# Altium project sy8502Regulator.PrjPcb
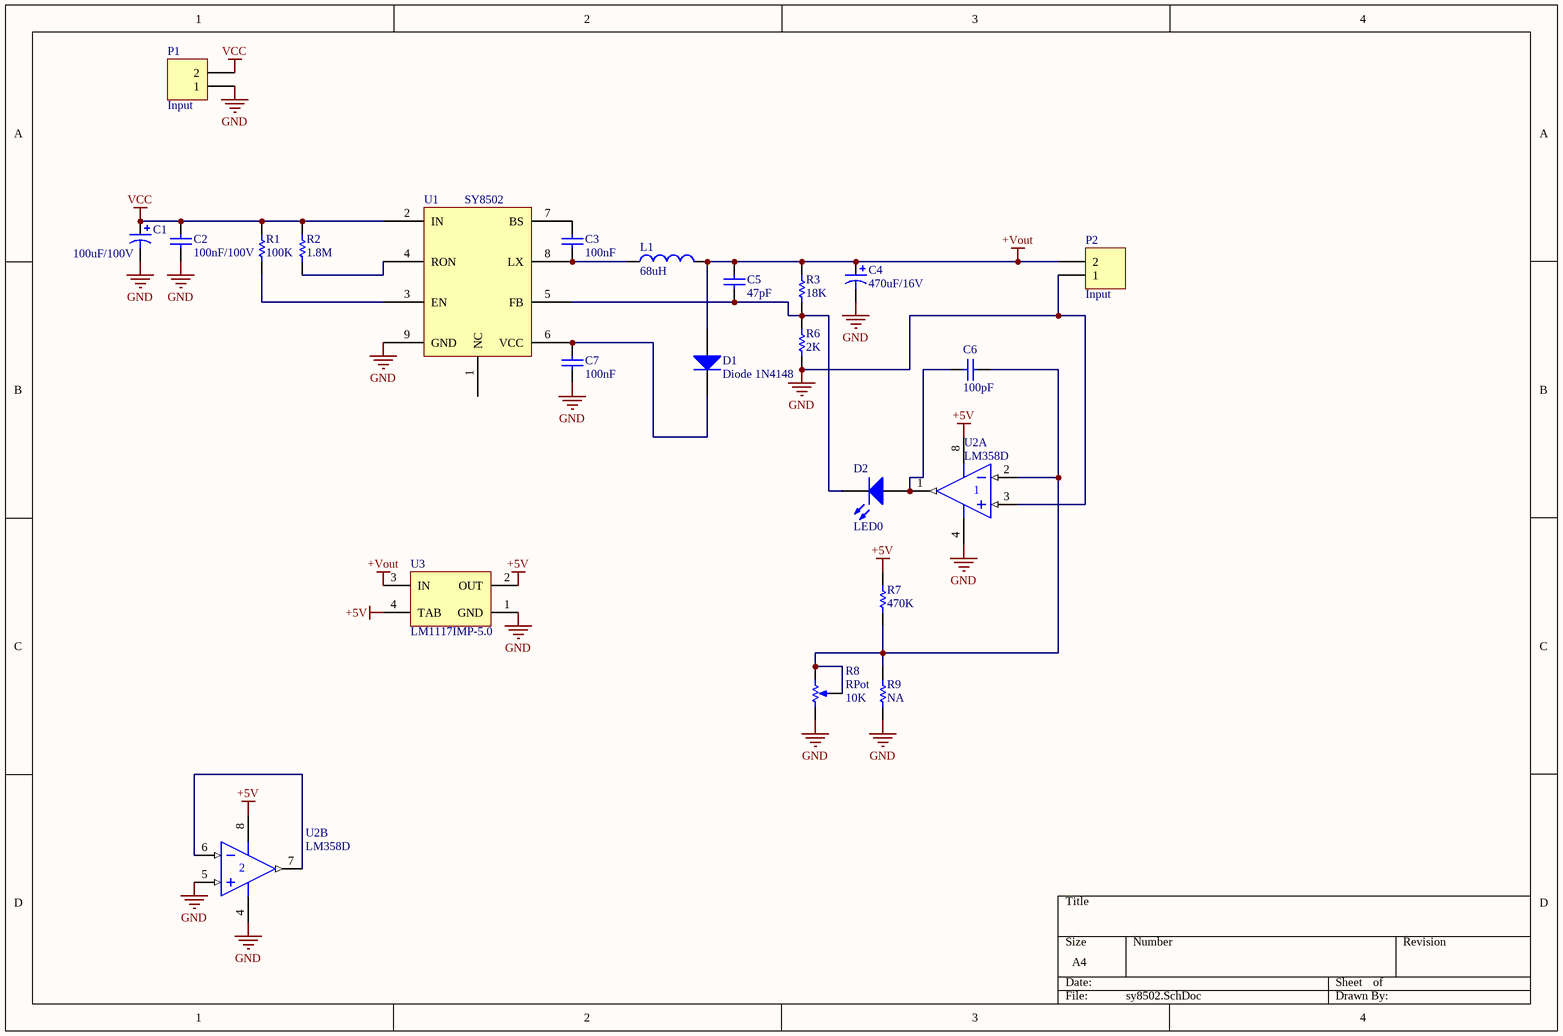
[diagram p0: sy8502.SchDoc]
1 sheet, 22 parts. Net scope: global (net labels, ports and power ports of the same name join across sheets).
Board file: SY8502.PcbDoc

## Sheet sy8502.SchDoc
size A4; SheetNumber: 1; SheetTotal: 1

### Parts
C1  100uF/100V  [C_EL_8]
C2  100nF/100V  [1206-Cap-S]
C3  100nF  [1206-Cap-S]
C4  470uF/16V  [C_EL_8]
C5  47pF  [1206-Cap-S]
C6  100pF  [1206-Cap-S]
C7  100nF  [1206-Cap-S]
D1  Diode 1N4148  [D1808]
D2  LED0  [LED1206GRN]
L1  68uH  [Bobin_smd_10*10]
P1  Input  [HDR1X2]
P2  Input  [HDR1X2]
R1  100K  [1206-Res-S]
R2  1.8M  [1206-Res-S]
R3  18K  [1206-Res-S]
R6  2K  [1206-Res-S]
R7  470K  [1206-Res-S]
R8  RPot  value 10K  [POT_3296W]
R9  NA  [1206-Res-S]
U1  SY8502  [SO_8T]
U2  LM358D  [SO_8]  (parts A,B of 2)
U3  LM1117IMP-5.0  [SOT223_4]

### Nets
+5V: R7.2 U2.8(V+) U3.2(OUT) U3.4(TAB)
+Vout: C4.1 C5.2 D1.1(A) L1.2 P2.2 R3.2 U3.3(IN)
GND: C1.2 C2.1 C4.2 C7.1 P1.1 P2.1 R6.1 R8.1(TOP) R9.1 U1.9(GND) U2.3(IN+) U2.4(V-) U2.5(IN+) U3.1(GND)
VCC: C1.1 C2.2 P1.2 R1.2 R2.2 U1.2(IN)
NetC3_1: C3.1 L1.1 U1.8(LX)
NetC3_2: C3.2 U1.7(BS)
NetC5_1: C5.1 D2.2(K) R3.1 R6.2 U1.5(FB)
NetC6_1: C6.1 R7.1 R8.2(BOT) R8.3(TAP) R9.2 U2.2(IN-)
NetC6_2: C6.2 D2.1(A) U2.1(OUT)
NetC7_2: C7.2 D1.2(K) U1.6(VCC)
NetR1_1: R1.1 U1.3(EN)
NetR2_1: R2.1 U1.4(RON)
NetU2_6: U2.6(IN-) U2.7(OUT)

Not connected (* = marked no-connect by the designer): U1 1(NC)

### Library data of the parts
C1 C4 = Cap Pol1: Polarized Capacitor (Radial); Published: 8-Jun-2000; LatestRevisionDate: 17-Jul-2002; LatestRevisionNote: Re-released for DXP Platform.; PackageReference: RB7.6-15; Publisher: Altium Limited; PackageDescription: Polarized Capacitor (Radial); 2 Leads
  C1: Value: 100uF/100V
  C4: Value: 470uF/16V
C2 C3 C5-C7 = Cap: Capacitor; Published: 8-Jun-2000; LatestRevisionDate: 17-Jul-2002; LatestRevisionNote: Re-released for DXP Platform.; PackageReference: RAD-0.3; Publisher: Altium Limited; PackageDescription: Radial Cap, Thru-Hole; 2 Leads; 0.3 in Pin Spacing
  C2: Value: 100nF/100V
  C3 C7: Value: 100nF
  C5: Value: 47pF
  C6: Value: 100pF
D1 = Diode 1N4148: High Conductance Fast Diode; Published: 8-Jun-2000; LatestRevisionDate: 17-Jul-2002; LatestRevisionNote: Re-released for DXP Platform.; DatasheetVersion: 1997; PackageReference: DO-35; Publisher: Altium Limited; PackageDescription: Diode, Axial; Body 3.8 x 1.9 mm (LxDia. max), Lead Dia. 0.53 mm (max); Code_JEDEC: DO-204-AH; ComponentLink1Description: Manufacturer Link; ComponentLink1URL: http://www.fairchildsemi.com/; ComponentLink2Description: Datasheet; ComponentLink2URL: http://www.fairchildsemi.com/ds/1N%2F1N4148.pdf
D2 = LED0: Typical INFRARED GaAs LED; Published: 8-Jun-2000; LatestRevisionDate: 08-Jul-2005; LatestRevisionNote: Mech Layer 1 removed.; PackageReference: LED-0; Publisher: Altium Limited; PackageDescription: LED; 2 Leads
L1 = Inductor: Code_IEC: 1005; Published: 8-Jun-2000; LatestRevisionDate: 29-May-2009; LatestRevisionNote: IPC-7351 Footprint Added.; PackageReference: 0402-A; Publisher: Altium Limited; PackageDescription: Chip Inductor; Code_JEITA: 0402; Value: 68uH
P1 P2 = Header 2: Header, 2-Pin; LatestRevisionDate: 17-Jul-2002; LatestRevisionNote: Re-released for DXP Platform.; Publisher: Altium Limited
R1-R3 R6 R7 R9 = Res1: Resistor; Published: 8-Jun-2000; LatestRevisionDate: 17-Jul-2002; LatestRevisionNote: Re-released for DXP Platform.; PackageReference: AXIAL-0.3; Publisher: Altium Limited; PackageDescription: Axial Device, Thru-Hole; 2 Leads; 0.3 in Pin Spacing
  R1: Value: 100K
  R2: Value: 1.8M
  R3: Value: 18K
  R6: Value: 2K
  R7: Value: 470K
  R9: Value: NA
R8 = RPot: Potentiometer; Sim Note: Enter the Resistance value and the set point into parameter fields.; Set Position: 0.5; Published: 8-Jun-2000; LatestRevisionDate: 17-Jul-2002; LatestRevisionNote: Re-released for DXP Platform.; PackageReference: VR5; Publisher: Altium Limited; PackageDescription: Variable Resistor, Thru-Hole; 3 Leads
U1 = SY8502: Step Down Regulator
U2 = LM358D: Dual Low-Power Operational Amplifier; Published: 17-Jul-2002; LatestRevisionDate: 13-Apr-2006; LatestRevisionNote: IPC-7351 Footprint Added.; DatasheetVersion: 1988; PackageReference: 751-02; Publisher: Altium Limited; PackageDescription: 8-Pin Small Outline Integrated Circuit 1.27 mm Pitch; Code_JEDEC: MS-012-AA; Code_IPC: SOIC127P600-8; ComponentLink1Description: Manufacturer Link; ComponentLink1URL: http://www.onsemi.com/site/products/parametrics/0,4446,251,00.html; ComponentLink2Description: Datasheet; ComponentLink2URL: http://www.onsemi.com/pub/Collateral/LM358-D.PDF
U3 = LM1117IMP-5.0: 800mA Low-Dropout Linear Regulator, 4-pin SOT-223; Manufacturer: National Semiconductor; PackageTopMarking: XYTT*N06B; PowerWise: N; CompType: LDO IC; Published: 4-Dec-2008; DatasheetVersion: Apr-2006; PackageVersion: revB, Apr-2003; PackageReference: MP04A; Publisher: Altium Limited; PackageDescription: Molded SOT-223, 6.50 x 3.56 x 1.6mm Body, 4 Lead, 2.3mm Pitch; Supplier 1: Farnell; Supplier Part Number 1: 7614135; PartNumber: LM1117IMP-5.0; RoHS: N; PinCount: 4; Code_JEDEC: TO-261-AA; Code_IPC: SOT223-4; ComponentLink1Description: LM1117 Datasheet; ComponentLink1URL: http://www.national.com/ds/LM/LM1117.pdf; ComponentLink2Description: LM1117 Web Page; ComponentLink2URL: http://www.national.com/pf/LM/LM1117.html; ComponentLink3Description: MP04A Package Page; ComponentLink3URL: http://www.national.com/packaging/folders/mp04a.html